# Altium project FIT_PM_TCM_Emulator.PrjPcb (part 3 of 4)

## Sheet SYSTEM.SchDoc
size A3; SheetNumber: 7; SheetTotal: 8; SPICEModelCacheQMXCVTWZ: <root> / <DocumentId>QMXCVTWZ</DocumentId> / <CacheFrame Number="0"> / <Model Name="pk14" Kind="CKT"> / <Text>*.INC dhvqfn.s / .SUBCKT pk14 / +    1   2   3   4   5   6   7   8   9  10 / +   11  12  13  14 / +   15  16  17  18  19  20  21  22  23  24 / +   25  26  27  28 / * Pin Resistance / r1 1 1001 9.078E-02 / r2 2 1002 8.829E-02 / r3 3 1003 8.731E-02 / r4 4 1004 8.710E-02 / r5 5 1005 8.731E-02 / r6 6 1006 8.829E-02 / r7 7 1007 9.075E-02 / r8 8 1008 9.072E-02 / r9 9 1009 8.809E-02 / r10 10 1010 8.716E-02 / r11 11 1011 8.706E-02 / r12 12 1012 8.720E-02 / r13 13 1013 8.816E-02 / r14 14 1014 9.068E-02 / * Pin Inductance / l1 1001 15 2.981E-09 / l2 1002 16 2.447E-09 / l3 1003 17 2.304E-09 / l4 1004 18 2.291E-09 / l5 1005 19 2.307E-09 / l6 1006 20 2.449E-09 / l7 1007 21 2.971E-09 / l8 1008 22 2.972E-09 / l9 1009 23 2.425E-09 / l10 1010 24 2.286E-09 / l11 1011 25 2.280E-09 / l12 1012 26 2.286E-09 / l13 1013 27 2.425E-09 / l14 1014 28 2.975E-09 / .ENDS pk14</Text> / </Model> / <Model Name="kpp" Kind="GlobalParam"> / <Text>.param KPP = 3.0E-05</Text> / </Model> / <Model Name="ldp" Kind="GlobalParam"> / <Text>.param LDP = 0.07U</Text> / </Model> / <Model Name="vtop" Kind="GlobalParam"> / <Text>.param VTOP = 0.14</Text> / </Model> / <Model Name="vt" Kind="GlobalParam"> / <Text>.param VT = 1.380649e-23*(273.15+TEMP)/1.60217662e-19</Text> / </Model> / <Model Name="rpar" Kind="GlobalParam"> / <Text>.param RPAR = 1T</Text> / </Model> / <Model Name="cbdj" Kind="GlobalParam"> / <Text>.param CBDJ = 1</Text> / </Model> / <Model Name="cn" Kind="GlobalParam"> / <Text>.param CN = 0.8</Text> / </Model> / <Model Name="cjp" Kind="GlobalParam"> / <Text>.param CJP = CN*300U</Text> / <Dependency>0\cn</Dependency> / </Model> / <Model Name="ls" Kind="GlobalParam"> / <Text>.param LS = 1.0U</Text> / </Model> / <Model Name="cbds" Kind="GlobalParam"> / <Text>.param CBDS = 1</Text> / </Model> / <Model Name="cjswp" Kind="GlobalParam"> / <Text>.param CJSWP = CN*2.2N</Text> / <Dependency>0\cn</Dependency> / </Model> / <Model Name="epssio2" Kind="GlobalParam"> / <Text>.param EPSSIO2 = 3.9*8.854214871E-12</Text> / </Model> / <Model Name="tox" Kind="GlobalParam"> / <Text>.param TOX = 1000E-10</Text> / </Model> / <Model Name="cox" Kind="GlobalParam"> / <Text>.param COX = EPSSIO2/TOX</Text> / <Dependency>0\epssio2</Dependency> / <Dependency>0\tox</Dependency> / </Model> / <Model Name="xjn" Kind="GlobalParam"> / <Text>.param XJN = 0.2U</Text> / </Model> / <Model Name="cgsop" Kind="GlobalParam"> / <Text>.param CGSOP = CN*0.6 * XJN * COX</Text> / <Dependency>0\cn</Dependency> / <Dependency>0\xjn</Dependency> / <Dependency>0\cox</Dependency> / </Model> / <Model Name="cgdop" Kind="GlobalParam"> / <Text>.param CGDOP = CGSOP</Text> / <Dependency>0\cgsop</Dependency> / </Model> / <Model Name="iimirrp" Kind="CKT"> / <Text>.SUBCKT IIMIRRP VCC IO II PARAMS: W1 = 100U L1 = 10U M1 = 1 W2 = 100U L2= 10U M2 = 2 IDIN = 1U / * / .PARAM L1E = {L1 - LDP} / .PARAM L2E = {L2 - LDP} / .PARAM B1 = {M1*(W1/L1)*(KPP/2)} / .PARAM MR = {M2*W2/L2E/(M1*W1/L1E)} / .PARAM RDS = {1/(2*SQRT(M2*(W2/L2E)*(KPP/2)*IDIN))} / .PARAM IS = 1E-12 / .PARAM NP = {VTOP/(VT*Log(1 + IDIN/IS))} / * / FB VCC IO V1 {MR} / R1 VCC IO {RPAR} / C1 VCC IO {M2*(CBDJ*CJP*LS*W2 + CBDS*CJSWP*(2*LS + W2))} / D1 IO  10  DMODP / V1 VCC 10 {VTOP} / R2 II 10  {RDS} / C2 VCC II {M1*(CBDJ*CJP*LS*W1 + CBDS*CJSWP*(2*LS + W1)) + 2/3*COX*(M1*W1*L1E + M2*W2*L2E) + M1*CGSOP*W1} / C3 II IO {CGDOP*W2} / .MODEL DMODP D (IS={IS} N={NP} ) / .ENDS</Text> / <Dependency>0\kpp</Dependency> / <Dependency>0\ldp</Dependency> / <Dependency>0\vtop</Dependency> / <Dependency>0\vt</Dependency> / <Dependency>0\rpar</Dependency> / <Dependency>0\cbdj</Dependency> / <Dependency>0\cjp</Dependency> / <Dependency>0\ls</Dependency> / <Dependency>0\cbds</Dependency> / <Dependency>0\cjswp</Dependency> / <Dependency>0\cox</Dependency> / <Dependency>0\cgsop</Dependency> / <Dependency>0\cgdop</Dependency> / </Model> / <Model Name="isz" Kind="GlobalParam"> / <Text>.param ISZ = 5P</Text> / </Model> / <Model Name="nz" Kind="GlobalParam"> / <Text>.param NZ = 0.3/(VT*Log(1 + 5.0M/ISZ))</Text> / <Dependency>0\vt</Dependency> / <Dependency>0\isz</Dependency> / </Model> / <Model Name="dz_18v" Kind="MDL"> / <Text>.MODEL DZ_18V D( IS={ISz} N={Nz} BV=18.0 IBV=5.0M EG={8*Nz*VT})</Text> / <Dependency>0\isz</Dependency> / <Dependency>0\nz</Dependency> / <Dependency>0\vt</Dependency> / </Model> / <Model Name="d_z18v" Kind="CKT"> / <Text>* / * CONNECTIONS:   A / *                |    C / *                |    | / .SUBCKT D_Z18V   1    2 / D1 1 2  DZ_18V / .ENDS</Text> / <Dependency>0\dz_18v</Dependency> / </Model> / <Model Name="kpn" Kind="GlobalParam"> / <Text>.param KPN = 6.0E-05</Text> / </Model> / <Model Name="ldn" Kind="GlobalParam"> / <Text>.param LDN = 0.07U</Text> / </Model> / <Model Name="rsw" Kind="GlobalParam"> / <Text>.param RSW = 1810</Text> / </Model> / <Model Name="rsn" Kind="GlobalParam"> / <Text>.param RSN = 1.41</Text> / </Model> / <Model Name="vbmul" Kind="GlobalParam"> / <Text>.param VBMUL = 1E6</Text> / </Model> / <Model Name="vtohp" Kind="GlobalParam"> / <Text>.param VTOHP = 0.85</Text> / </Model> / <Model Name="lambda" Kind="GlobalParam"> / <Text>.param LAMBDA = 2M</Text> / </Model> / <Model Name="vtohn" Kind="GlobalParam"> / <Text>.param VTOHN = 0.80</Text> / </Model> / <Model Name="ibias" Kind="CKT"> / <Text>* / .SUBCKT IBIAS VCC GND VIB / * / .PARAM M1 = 8 / .PARAM M2 = 5 / .PARAM MP = 1 / .PARAM WP = 13U / .PARAM WN = 130U / .PARAM LPE = {36U - LDP} / .PARAM LNE = {13U - LDN} / .PARAM BP = {MP*(WP/LPE)*(KPP/2)} / .PARAM WW = 13U / .PARAM LW = 213U / .PARAM WNN = 25U / .PARAM LNN = 87U / .PARAM R1 = {(RSW*LW/WW + RSN*LNN/WNN)} / .PARAM K2 = {M2*(WN/LNE)*(KPN/2)} / .PARAM MR = {M2/M1} / * / R1 VIB GND {VBMUL} / GB  VCC VIB  VALUE = {LIMIT( IF ( V(VCC,GND) &gt; VTOHP, BP*PWR(V(VCC,GND)-VTOHP, 2), 0), / + (1 + 1*LAMBDA*(V(VCC,GND) - VTOHN))*PWR(( 1 - SQRT(MR/(1+2*LAMBDA*(V(VCC,GND) - VTOHP))) )/R1, 2)/K2, 0)} / R2 VIB VCC {RPAR} / .ENDS</Text> / <Dependency>0\kpp</Dependency> / <Dependency>0\kpn</Dependency> / <Dependency>0\ldn</Dependency> / <Dependency>0\ldp</Dependency> / <Dependency>0\rsw</Dependency> / <Dependency>0\rsn</Dependency> / <Dependency>0\vbmul</Dependency> / <Dependency>0\vtohp</Dependency> / <Dependency>0\lambda</Dependency> / <Dependency>0\vtohn</Dependency> / <Dependency>0\rpar</Dependency> / </Model> / <Model Name="vton" Kind="GlobalParam"> / <Text>.param VTON = 0.14</Text> / </Model> / <Model Name="cjn" Kind="GlobalParam"> / <Text>.param CJN = CN*180U</Text> / <Dependency>0\cn</Dependency> / </Model> / <Model Name="cjswn" Kind="GlobalParam"> / <Text>.param CJSWN = CN*1N</Text> / <Dependency>0\cn</Dependency> / </Model> / <Model Name="cgson" Kind="GlobalParam"> / <Text>.param CGSON = CN*0.6 * XJN * COX</Text> / <Dependency>0\cn</Dependency> / <Dependency>0\xjn</Dependency> / <Dependency>0\cox</Dependency> / </Model> / <Model Name="cgdon" Kind="GlobalParam"> / <Text>.param CGDON = CGSON</Text> / <Dependency>0\cgson</Dependency> / </Model> / <Model Name="iimirrn" Kind="CKT"> / <Text>.SUBCKT IIMIRRN GND IO II PARAMS: W1 = 100U L1 = 10U M1 = 1 W2 = 100U L2= 10U M2 = 2 IDIN = 1U / * / .PARAM L1E = {L1 - LDN} / .PARAM L2E = {L2 - LDN} / .PARAM B1 = {M1*(W1/L1)*(KPN/2)} / .PARAM MR = { M2*W2/L2E/(M1*W1/L1E) } / .PARAM RDS = {1/(2*SQRT(M2*(W2/L2E)*(KPN/2)*IDIN))} / .PARAM IS = 1E-12 / .PARAM NN = {VTON/(VT*Log(1 + IDIN/IS))} / * / FB IO GND V1 {MR} / R1 IO GND {RPAR} / C1 IO GND {M2*(CBDJ*CJN*LS*W2 + CBDS*CJSWN*(2*LS + W2))} / D1 10 IO  DMODN / V1 10 GND {VTON} / R2 II 10  {RDS} / C2 II GND {M1*(CBDJ*CJN*LS*W1 + CBDS*CJSWN*(2*LS + W1)) + 2/3*COX*(M1*W1*L1E + M2*W2*L2E) + M1*CGSON*W1} / C3 II IO {M2*CGDON*W2} / .MODEL DMODN D (IS={IS} N={NN} ) / .ENDS</Text> / <Dependency>0\kpn</Dependency> / <Dependency>0\ldn</Dependency> / <Dependency>0\vton</Dependency> / <Dependency>0\vt</Dependency> / <Dependency>0\rpar</Dependency> / <Dependency>0\cbdj</Dependency> / <Dependency>0\cjn</Dependency> / <Dependency>0\ls</Dependency> / <Dependency>0\cbds</Dependency> / <Dependency>0\cjswn</Dependency> / <Dependency>0\cox</Dependency> / <Dependency>0\cgson</Dependency> / <Dependency>0\cgdon</Dependency> / </Model> / <Model Name="tlc55x_rwelld" Kind="CKT"> / <Text>*$ / .SUBCKT TLC55X_RWELLD  1 2 PARAMS: W = 10U L = 100U / R1 1 2 {RSW*L/W} / .ENDS</Text> / <Dependency>0\rsw</Dependency> / </Model> / <Model Name="tlc55x_rwell" Kind="CKT"> / <Text>*+ RSH= 10 / *$ / .SUBCKT TLC55X_RWELL  1 2 PARAMS: W = 10U L = 100U / XR1 1 2 TLC55X_RWELLD PARAMS: W = {W} L = {L} / .ENDS</Text> / <Dependency>0\tlc55x_rwelld</Dependency> / </Model> / <Model Name="mdswn" Kind="CKT"> / <Text>.SUBCKT MDSWN D S DG GND PARAMS: W = 100U L = 10U M = 1 / * / .PARAM LE = {L - LDN} / * / S1 D S DG GND SWN / C1 D S {M*(CBDJ*CJN*LS*W + CBDS*CJSWN*(2*LS + W))} / *D B / .MODEL SWN VSWITCH ( VON = {0.55} VOFF = {0.49} RON={1/(2*M*(W/LE)*(KPN/2)*10)} ROFF={1G} ) / .ENDS</Text> / <Dependency>0\kpn</Dependency> / <Dependency>0\ldn</Dependency> / <Dependency>0\cbdj</Dependency> / <Dependency>0\cjn</Dependency> / <Dependency>0\ls</Dependency> / <Dependency>0\cbds</Dependency> / <Dependency>0\cjswn</Dependency> / </Model> / <Model Name="ccg" Kind="GlobalParam"> / <Text>.param CCG = 0.2</Text> / </Model> / <Model Name="xjncg" Kind="GlobalParam"> / <Text>.param XJNCG = 0.2U</Text> / </Model> / <Model Name="toxcg" Kind="GlobalParam"> / <Text>.param TOXCG = 1000E-10</Text> / </Model> / <Model Name="coxcg" Kind="GlobalParam"> / <Text>.param COXCG = EPSSIO2/TOXCG</Text> / <Dependency>0\epssio2</Dependency> / <Dependency>0\toxcg</Dependency> / </Model> / <Model Name="cgsoncg" Kind="GlobalParam"> / <Text>.param CGSONCG = CCG*0.6 * XJNCG * COXCG</Text> / <Dependency>0\ccg</Dependency> / <Dependency>0\xjncg</Dependency> / <Dependency>0\coxcg</Dependency> / </Model> / <Model Name="cgdoncg" Kind="GlobalParam"> / <Text>.param CGDONCG = CGSONCG</Text> / <Dependency>0\cgsoncg</Dependency> / </Model> / <Model Name="cjncg" Kind="GlobalParam"> / <Text>.param CJNCG = CCG*180U</Text> / <Dependency>0\ccg</Dependency> / </Model> / <Model Name="cjswncg" Kind="GlobalParam"> / <Text>.param CJSWNCG = CCG*1N</Text> / <Dependency>0\ccg</Dependency> / </Model> / <Model Name="vtomp" Kind="GlobalParam"> / <Text>.param VTOMP = 0.6</Text> / </Model> / <Model Name="tlc55x_pmosd_mv" Kind="MDL"> / <Text>*$ / .MODEL TLC55X_PMOSD_MV PMOS LEVEL=1 L=10U W=100U KP={KPP} VTO={-VTOMP} LAMBDA=2E-3 / *+ CJ={CJP} CJSW={CJSWP} CGSO={CGSOP} CGDO={CGDOP} PB=0.65 LD=70N TOX={TOX} / + CJ={CJNCG} CJSW={CJSWNCG} CGSO={CGSONCG} CGDO={CGDONCG} PB=0.65 LD= 70N TOX={TOXCG}</Text> / <Dependency>0\cgdoncg</Dependency> / <Dependency>0\cgsoncg</Dependency> / <Dependency>0\cjncg</Dependency> / <Dependency>0\cjswncg</Dependency> / <Dependency>0\kpp</Dependency> / <Dependency>0\toxcg</Dependency> / <Dependency>0\vtomp</Dependency> / </Model> / <Model Name="tlc55x_pmos_mv" Kind="CKT"> / <Text>*$ / .SUBCKT TLC55X_PMOS_MV  D G S B PARAMS: W = 100U L = 10U M = 1 / M1 D G S B TLC55X_PMOSD_MV W = {W} L = {L} M = {M} AD={W*LS} AS={W*LS} PD={W + 2*LS} PS={W + 2*LS} / + NRD={LS/W} NRS={LS/W} / .ENDS</Text> / <Dependency>0\tlc55x_pmosd_mv</Dependency> / <Dependency>0\ls</Dependency> / </Model> / <Model Name="mdswp" Kind="CKT"> / <Text>.SUBCKT MDSWP D S DG GND PARAMS: W = 100U L = 10U M = 1 / * / .PARAM LE = {L - LDP} / * / S1 D S DG GND SWN / C1 D S {M*(CBDJ*CJP*LS*W + CBDS*CJSWP*(2*LS + W))} / *D B / .MODEL SWN VSWITCH ( VON = {0.49} VOFF = {0.55} RON={1/(2*M*(W/LE)*(KPP/2)*10)} ROFF={1G} ) / .ENDS</Text> / <Dependency>0\kpp</Dependency> / <Dependency>0\ldp</Dependency> / <Dependency>0\cbdj</Dependency> / <Dependency>0\cjp</Dependency> / <Dependency>0\ls</Dependency> / <Dependency>0\cbds</Dependency> / <Dependency>0\cjswp</Dependency> / </Model> / <Model Name="imirrp" Kind="CKT"> / <Text>.SUBCKT IMIRRP VCC IO VIB GND PARAMS: W = 100U L = 10U M = 1 IO = 1U / * / .PARAM MP = 1 / .PARAM WP = 13U / .PARAM LPE = {36U - LDP} / .PARAM LE = {L - LDP} / .PARAM MR = { M*W/LE/(MP*WP/LPE)/VBMUL } / .PARAM B1 = { (KPP/2*MP*WP/LPE)*VBMUL } / .PARAM IS = 1E-12 / .PARAM N = {VTOHP/(VT*Log(1 + IO/IS))} / * / GB VCC IO VIB GND {MR} / R1 VCC IO {RPAR} / C1 VCC IO {M*(CBDJ*CJP*LS*W + CBDS*CJSWP*(2*LS + W))} / V1 VCC 10 {VTOHP} / D1 IO  10  DMOD1 / .MODEL DMOD1 D (IS={IS} N={N} ) / .ENDS</Text> / <Dependency>0\kpp</Dependency> / <Dependency>0\vbmul</Dependency> / <Dependency>0\ldp</Dependency> / <Dependency>0\vtohp</Dependency> / <Dependency>0\vt</Dependency> / <Dependency>0\rpar</Dependency> / <Dependency>0\cbdj</Dependency> / <Dependency>0\cjp</Dependency> / <Dependency>0\ls</Dependency> / <Dependency>0\cbds</Dependency> / <Dependency>0\cjswp</Dependency> / </Model> / <Model Name="comp2inpnorsd" Kind="CKT"> / <Text>.SUBCKT COMP2INPNORSD IN1+ IN1- IN2+ IN2- OUT GND / + PARAMS: ROUT=0 DELAYLH=0 DELAYHL=0 VOUTH=0 VOUTL=0 VTHRES1=0 VTHRES2=0 / * / .PARAM TDELLH = {IF ( (DELAYLH &lt; 1E-9) , 1E-9, DELAYLH ) } / .PARAM TDELHL = {IF ( (DELAYHL &lt; 1E-9) , 1E-9, DELAYHL ) } / .PARAM RO = {IF ( (TDEL &gt; 1E-15) &amp; (ROUT &lt; 1), 1, ROUT ) } / .PARAM TDEL = {(TDELLH+TDELHL)/2} / .PARAM COUT={TDEL/(0.693*(RO+1U))} / .PARAM RDELLH = {TDELLH/(0.693*(COUT+1F))} / .PARAM RDELHL = {TDELHL/(0.693*(COUT+1F))} / EOUT OUT GND VALUE= { IF ( (V(IN1+,IN1-) &gt; {VTHRES1}) | (V(IN2+,IN2-) &gt; {VTHRES2}), / + VOUTL + RDELLH*I(EOUT), VOUTH + RDELHL*I(EOUT) ) } / COUT OUT GND {COUT} / .ENDS COMP2INPNORSD</Text> / </Model> / <Model Name="comp3inpnorsd" Kind="CKT"> / <Text>.SUBCKT COMP3INPNORSD IN1+ IN1- IN2+ IN2- IN3+ IN3- OUT VCC GND / + PARAMS: ROUT=0 DELAYLH=0 DELAYHL=0 VOUTH=0 VOUTL=0 VTHRES1=0 VHYST1=0 VTHRES2=0 VHYST2=0 VTHRES3=0 VHYST3=0 / * / .PARAM TDELLH = {IF ( (DELAYLH &lt; 1E-9) , 1E-9, DELAYLH ) } / .PARAM TDELHL = {IF ( (DELAYHL &lt; 1E-9) , 1E-9, DELAYHL ) } / .PARAM RO = {IF ( (TDEL &gt; 1E-15) &amp; (ROUT &lt; 1), 1, ROUT ) } / .PARAM TDEL = {(TDELLH+TDELHL)/2} / .PARAM COUT={TDEL/(0.693*(RO+1U))} / .PARAM VREFN = {(15-VTOHN)} / .PARAM VREFP = {(15-VTOHP)} / .PARAM RDELLH = {TDELLH/(0.693*(COUT+1F))*VREFP} / .PARAM RDELHL = {TDELHL/(0.693*(COUT+1F))*VREFN} / * / EOUT OUT GND VALUE= { IF ( (V(IN1+,IN1-) &gt; {VTHRES1}) | (V(IN2+,IN2-) &gt; {VTHRES2}) | (V(IN3+,IN3-) &gt; {VTHRES3}), / + VOUTL + RDELLH*I(EOUT)*V(1,GND), VOUTH + RDELHL*I(EOUT)*V(1,GND) ) } / E1 1 GND VALUE= { IF ( (V(VCC,GND) &gt; {VTOHP+0.01}), 1/(V(VCC,GND)-VTOHP), 100 ) } / COUT OUT GND {COUT} / .ENDS COMP3INPNORSD</Text> / <Dependency>0\vtohn</Dependency> / <Dependency>0\vtohp</Dependency> / </Model> / <Model Name="rr1sff" Kind="CKT"> / <Text>.SUBCKT RR1SFF S R R1 Q  Q_ VCC GND / + PARAMS: VOUTH=5.0 VOUTL=0 RIN=1E12 DELAY=10N ROUT=10 / .PARAM W1 = 100U / .PARAM L1 = 10U / .PARAM W2 = 100U / .PARAM L2= 10U / .PARAM W3 = 10U / .PARAM L3 = 25U / .PARAM W4 = 10U / .PARAM L4= 100U / * / XU1     Q GND S GND Q_ GND   COMP2INPNORSD / + PARAMS: ROUT={ROUT} DELAYLH={1N} DELAYHL={1N} VOUTH={VOUTH} VOUTL={VOUTL} / + VTHRES1={0.5*(VOUTH-VOUTL)} VTHRES2={VTOCN} / XU2     VCC R R1 GND Q_ GND Q VCC GND   COMP3INPNORSD / + PARAMS: ROUT={ROUT} DELAYLH={15N} DELAYHL={1N} VOUTH={VOUTH} VOUTL={VOUTL} / + VTHRES1={VTOCP} VTHRES2={VTOCN} VTHRES3={0.49*(VOUTH-VOUTL)} / *C1 S GND {0.5*COX*(W1*L1) + CGSON*W1} / *C2 R VCC {0.5*COX*(W2*L2) + CGSOP*W2} / *C3 R1 GND {0.5*COX*(W3*L3) + CGSON*W3} / *C4 R1 VCC {0.5*COX*(W4*L4) + CGSOP*W4} / .ENDS</Text> / <Dependency>0\comp2inpnorsd</Dependency> / <Dependency>0\comp3inpnorsd</Dependency> / </Model> / <Model Name="vtomn" Kind="GlobalParam"> / <Text>.param VTOMN = 0.55</Text> / </Model> / <Model Name="tlc55x_nmosd_mv" Kind="MDL"> / <Text>*$ / .MODEL TLC55X_NMOSD_MV NMOS LEVEL=1 L=10U W=100U KP={KPN} VTO={VTOMN} LAMBDA=2E-3 / + CJ={CJNCG} CJSW={CJSWNCG} CGSO={CGSONCG} CGDO={CGDONCG} PB=0.65 LD= 70N TOX={TOXCG}</Text> / <Dependency>0\cgdoncg</Dependency> / <Dependency>0\cgsoncg</Dependency> / <Dependency>0\cjncg</Dependency> / <Dependency>0\cjswncg</Dependency> / <Dependency>0\kpn</Dependency> / <Dependency>0\toxcg</Dependency> / <Dependency>0\vtomn</Dependency> / </Model> / <Model Name="tlc55x_nmos_mv" Kind="CKT"> / <Text>*$ / .SUBCKT TLC55X_NMOS_MV  D G S B PARAMS: W = 100U L = 10U M = 1 / M1 D G S B TLC55X_NMOSD_MV W = {W} L = {L} M = {M} AD={W*LS} AS={W*LS} PD={W + 2*LS} PS={W + 2*LS} / + NRD={LS/W} NRS={LS/W} / .ENDS</Text> / <Dependency>0\tlc55x_nmosd_mv</Dependency> / <Dependency>0\ls</Dependency> / </Model> / <Model Name="mswn" Kind="CKT"> / <Text>.SUBCKT MSWN D G S PARAMS: W = 100U L = 10U M = 1 / * / .PARAM LE = {L - LDN} / * / *C1 D S {M*(CBDJ*CJN*LS*W + CBDS*CJSWN*(2*LS + W))} / *D B / *C2 G S {M*2/3*COX*(W*LE) + CGSON*W} / *C3 G D {CGDON*W} / S1 D S G S SWN / .MODEL SWN VSWITCH ( VON = {VTON+1} VOFF = {VTON} RON={1/(2*M*(W/L)*(KPN/2)*10)} ROFF={1G} ) / .ENDS</Text> / <Dependency>0\vton</Dependency> / <Dependency>0\kpn</Dependency> / <Dependency>0\ldn</Dependency> / </Model> / <Model Name="tlc55x_nmosd_hv" Kind="MDL"> / <Text>*$ / .MODEL TLC55X_NMOSD_HV NMOS LEVEL=3 L=10U W=100U KP={KPN} VTO={VTOHN} LAMBDA=2E-3 THETA=1.8E-01 / + CJ={CJN} CJSW={CJSWN} CGSO={CGSON} CGDO={CGDON} RSH= 10 PB=0.65 LD= 70N TOX={TOX}</Text> / <Dependency>0\cgdon</Dependency> / <Dependency>0\cgson</Dependency> / <Dependency>0\cjn</Dependency> / <Dependency>0\cjswn</Dependency> / <Dependency>0\kpn</Dependency> / <Dependency>0\tox</Dependency> / <Dependency>0\vtohn</Dependency> / </Model> / <Model Name="tlc55x_nmos_hv" Kind="CKT"> / <Text>.SUBCKT TLC55X_NMOS_HV  D G S B PARAMS: W = 100U L = 10U M = 1 / M1 D G S B TLC55X_NMOSD_HV W = {W} L = {L} M = {M} AD={W*LS} AS={W*LS} PD={W + 2*LS} PS={W + 2*LS} / + NRD={LS/W} NRS={LS/W} / .ENDS</Text> / <Dependency>0\tlc55x_nmosd_hv</Dependency> / <Dependency>0\ls</Dependency> / </Model> / <Model Name="tlc55x_pmosd_hv" Kind="MDL"> / <Text>*$ / .MODEL TLC55X_PMOSD_HV PMOS LEVEL=3 L=10U W=100U KP={KPP} VTO={-VTOHP} LAMBDA=2E-3 THETA=2.2E-01 / + CJ={CJP} CJSW={CJSWP} CGSO={CGSOP} CGDO={CGDOP} RSH=10 PB=0.65 LD=70N TOX={TOX}</Text> / <Dependency>0\cgdop</Dependency> / <Dependency>0\cgsop</Dependency> / <Dependency>0\cjp</Dependency> / <Dependency>0\cjswp</Dependency> / <Dependency>0\kpp</Dependency> / <Dependency>0\tox</Dependency> / <Dependency>0\vtohp</Dependency> / </Model> / <Model Name="tlc55x_pmos_hv" Kind="CKT"> / <Text>*+ RSH= 10 / *$ / .SUBCKT TLC55X_PMOS_HV  D G S B PARAMS: W = 100U L = 10U M = 1 / M1 D G S B TLC55X_PMOSD_HV W = {W} L = {L} M = {M} AD={W*LS} AS={W*LS} PD={W + 2*LS} PS={W + 2*LS} / + NRD={LS/W} NRS={LS/W} / .ENDS</Text> / <Dependency>0\tlc55x_pmosd_hv</Dependency> / <Dependency>0\ls</Dependency> / </Model> / <Model Name="tlc55x_nmosd_hv_l1" Kind="MDL"> / <Text>*$ / .MODEL TLC55X_NMOSD_HV_L1 NMOS LEVEL=1 L=10U W=100U KP={KPN} VTO={VTOHN} LAMBDA=2E-3 / + CJ={CJN} CJSW={CJSWN} CGSO={CGSON} CGDO={CGDON} RSH= 10 PB=0.65 LD= 70N TOX={TOX}</Text> / <Dependency>0\cgdon</Dependency> / <Dependency>0\cgson</Dependency> / <Dependency>0\cjn</Dependency> / <Dependency>0\cjswn</Dependency> / <Dependency>0\kpn</Dependency> / <Dependency>0\tox</Dependency> / <Dependency>0\vtohn</Dependency> / </Model> / <Model Name="tlc55x_nmos_hv_l1" Kind="CKT"> / <Text>*$ / .SUBCKT TLC55X_NMOS_HV_L1  D G S B PARAMS: W = 100U L = 10U M = 1 / M1 D G S B TLC55X_NMOSD_HV_L1 W = {W} L = {L} M = {M} AD={W*LS} AS={W*LS} PD={W + 2*LS} PS={W + 2*LS} / + NRD={LS/W} NRS={LS/W} / .ENDS</Text> / <Dependency>0\tlc55x_nmosd_hv_l1</Dependency> / <Dependency>0\ls</Dependency> / </Model> / <Model Name="tlc55x_pmosd_lv" Kind="MDL"> / <Text>*+ RSH= 10 / *$ / .MODEL TLC55X_PMOSD_LV PMOS LEVEL=1 L=10U W=100U KP={KPP} VTO={-VTOP} LAMBDA=2E-3 / + CJ={CJP} CJSW={CJSWP} CGSO={CGSOP} CGDO={CGDOP}  PB=0.65 LD=300N TOX={TOX}</Text> / <Dependency>0\cgdop</Dependency> / <Dependency>0\cgsop</Dependency> / <Dependency>0\cjp</Dependency> / <Dependency>0\cjswp</Dependency> / <Dependency>0\kpp</Dependency> / <Dependency>0\tox</Dependency> / <Dependency>0\vtop</Dependency> / </Model> / <Model Name="tlc55x_pmos_lv" Kind="CKT"> / <Text>*$ / .SUBCKT TLC55X_PMOS_LV  D G S B PARAMS: W = 100U L = 10U M = 1 / M1 D G S B TLC55X_PMOSD_LV W = {W} L = {L} M = {M} AD={W*LS} AS={W*LS} PD={W + 2*LS} PS={W + 2*LS} / + NRD={LS/W} NRS={LS/W} / .ENDS</Text> / <Dependency>0\tlc55x_pmosd_lv</Dependency> / <Dependency>0\ls</Dependency> / </Model> / <Model Name="tlc555" Kind="CKT"> / <Text>.SUBCKT TLC555 THRES CONT TRIG RESET OUT DISC VCC GND / XD8          GND RESI   D_Z18V / XD7          GND RESET   D_Z18V / XR2          RESET RESI   TLC55X_RWELL / + PARAMS: W=50u L=20u / XD2          GND TRGI   D_Z18V / XD1          GND TRIG   D_Z18V / XR3          TRIG TRGI   TLC55X_RWELL / + PARAMS: W=50u L=20u / XD4          GND THRI   D_Z18V / XD3          GND THRES   D_Z18V / XR2_2        THRES THRI   TLC55X_RWELL / + PARAMS: W=50u L=20u / XD6          GND CONTI   D_Z18V / XD5          GND CONT   D_Z18V / XR2_3        CONT CONTI   TLC55X_RWELL / + PARAMS: W=50u L=20u / XMN15        GOUT GND QFF GND   MDSWN / + PARAMS: W=100U L=10U M=7 / XMP15        GOUT VCC QFF GND   MDSWP / + PARAMS: W=195U L=10U M=9 / XMN3         GND TRGO 23   IIMIRRN / + PARAMS: W1=170U L1=18U M1=1 W2=170U L2=18U M2=1 IDIN=1U / XMN5         GND THRS 25   IIMIRRN / + PARAMS: W1=13U L1=26U M1=1 W2=52U L2=13U M2=2 IDIN=50N / XMp9         VCC RESO 15 GND   IMIRRP / + PARAMS: W=112U L=15U M=2 IO=2U / XMp6         VCC 25 15 GND   IMIRRP / + PARAMS: W=18U L=26U M=1 IO=100n / XMp5         VCC TRGS 15 GND   IMIRRP / + PARAMS: W=112U L=15U M=2 IO=2U / XMp1         VCC THRO 29   IIMIRRP / + PARAMS: W1=172U L1=15U M1=1 W2=172U L2=15U M2=1 IDIN=1U / XIB          VCC GND 15   IBIAS / XRSFF        TRGO THRO RESO QFF 30 VCC GND   RR1SFF / + PARAMS: VOUTH=1 VOUTL=0 RIN=1E12 DELAY=30N ROUT=10 / XMN9         TRGO RESO GND   MSWN / + PARAMS: W=100U L=10U M=1 / XMN17        DISC GOUT GND GND   TLC55X_NMOS_HV / + PARAMS: W=350U L=10U M=20 / XMN16        OUT GOUT GND GND   TLC55X_NMOS_HV / + PARAMS: W=175U L=10U M=20 / XMP16        OUT GOUT VCC VCC   TLC55X_PMOS_HV / + PARAMS: W=270u L=10u M=7 / XMN10        RESO RESI GND GND   TLC55X_NMOS_HV_L1 / + PARAMS: W=100u L=10u M=1 / XMN2         THRO THRI THRS GND   TLC55X_NMOS_MV / + PARAMS: W=170u L=18u M=2 / XMP4         TRGO TRGI TRGS VCC   TLC55X_PMOS_MV / + PARAMS: W=172u L=15u M=2 / XMP3         23 TRGC TRGS VCC   TLC55X_PMOS_MV / + PARAMS: W=172u L=15u M=2 / XMPR1F       GND GND 32 TRGC   TLC55X_PMOS_LV / + PARAMS: W=20U L=15U M=1 / XMPR1E       32 32 TRGC TRGC   TLC55X_PMOS_LV / + PARAMS: W=20U L=15U M=1 / XMPR1D       TRGC TRGC 33 CONTI   TLC55X_PMOS_LV / + PARAMS: W=20U L=15U M=1 / XMPR1C       33 33 CONTI CONTI   TLC55X_PMOS_LV / + PARAMS: W=20U L=15U M=1 / XMPR1B       CONTI CONTI 34 VCC   TLC55X_PMOS_LV / + PARAMS: W=20u L=15u M=1 / XMPR1A       34 34 VCC VCC   TLC55X_PMOS_LV / + PARAMS: W=20u L=15u M=1 / XMN1         29 CONTI THRS GND   TLC55X_NMOS_MV / + PARAMS: W=170u L=18u M=2 / .ENDS TLC555</Text> / <Dependency>0\iimirrp</Dependency> / <Dependency>0\d_z18v</Dependency> / <Dependency>0\ibias</Dependency> / <Dependency>0\iimirrn</Dependency> / <Dependency>0\tlc55x_rwell</Dependency> / <Dependency>0\mdswn</Dependency> / <Dependency>0\tlc55x_pmos_mv</Dependency> / <Dependency>0\mdswp</Dependency> / <Dependency>0\imirrp</Dependency> / <Dependency>0\rr1sff</Dependency> / <Dependency>0\tlc55x_nmos_mv</Dependency> / <Dependency>0\mswn</Dependency> / <Dependency>0\tlc55x_nmos_hv</Dependency> / <Dependency>0\tlc55x_pmos_hv</Dependency> / <Dependency>0\tlc55x_nmos_hv_l1</Dependency> / <Dependency>0\tlc55x_pmos_lv</Dependency> / </Model> / <Model Name="bsh103" Kind="CKT"> / <Text>.SUBCKT BSH103 DRAIN GATE SOURCE / LD DRAIN 5 7e-10 / RLD2 DRAIN 5 1.7592904 / RLD1 5 4 0.00035 / LG GATE 1 2.8e-09 / RLG GATE 1 7.0371616 / LS SOURCE 8 8e-10 / RLS2 SOURCE 8 2.0106176 / RLS1 8 7 0.0069 / RDS 7 4 240000000 TC=-0.05 / RS 6 7 0.0001 / RD 3 4 0.167989599257517 TC=0.00346248128119176,-2.23221620156079e-06 / RBD 9 4 0.0853481926973045 TC=0.00346248128119176,-2.23221620156079e-06 / DBD 7 9 DBD / M1 3 2 6 6 MINT / RGS 2 6 80000000 / CGS 2 6 7.24e-11 / RG 1 2 1.767 / * CGD / C11    11   12   1E-12 / V11    11   0   0Vdc / G11    3 2 VALUE { V(13, 0)*I(V11) } / E11    12   0  3 2  1 / E12    13   0  TABLE {V(12)} / + -10	175 / + -5	175 / + -2	175 / + -1	175 / + -0.5	175 / + -0.2	175 / + -0.1	175 / + 0	175 / + 0.01	175 / + 0.5	100 / + 1	70 / + 1.5	60 / + 2	52 / + 2.5	46 / + 3	41 / + 3.5	38 / + 4	35 / + 4.5	33 / + 5	30 / + 7.5	25 / + 10	20 / + 12.5	19 / + 15	18 / + 17.5	16 / + 20	15 / + 25	14 / .MODEL MINT NMOS(Vto=0.8044653308583916 Kp=2.995 Nfs=600e+09 Eta=0 / + Level=3 L=1e-4 W=1e-4 Gamma=0 Phi=0.6 Is=1e-24 / + Js=0 Pb=0.8 Cj=0 Cjsw=0 Cgso=0 Cgdo=0 Cgbo=0 / + Tox=1e-07 Xj=0 / + U0=600 Vmax=4000) / .MODEL DBD D(Bv=30.00 Ibv=1.00E-05 Rs=1E-6 Is=6.14153744662471e-14 / + N=1 M=0.1 VJ=0.5 Fc=0.5 Cjo=0 Tt=2.5e-09) / .ENDS</Text> / </Model> / </CacheFrame> / </root>
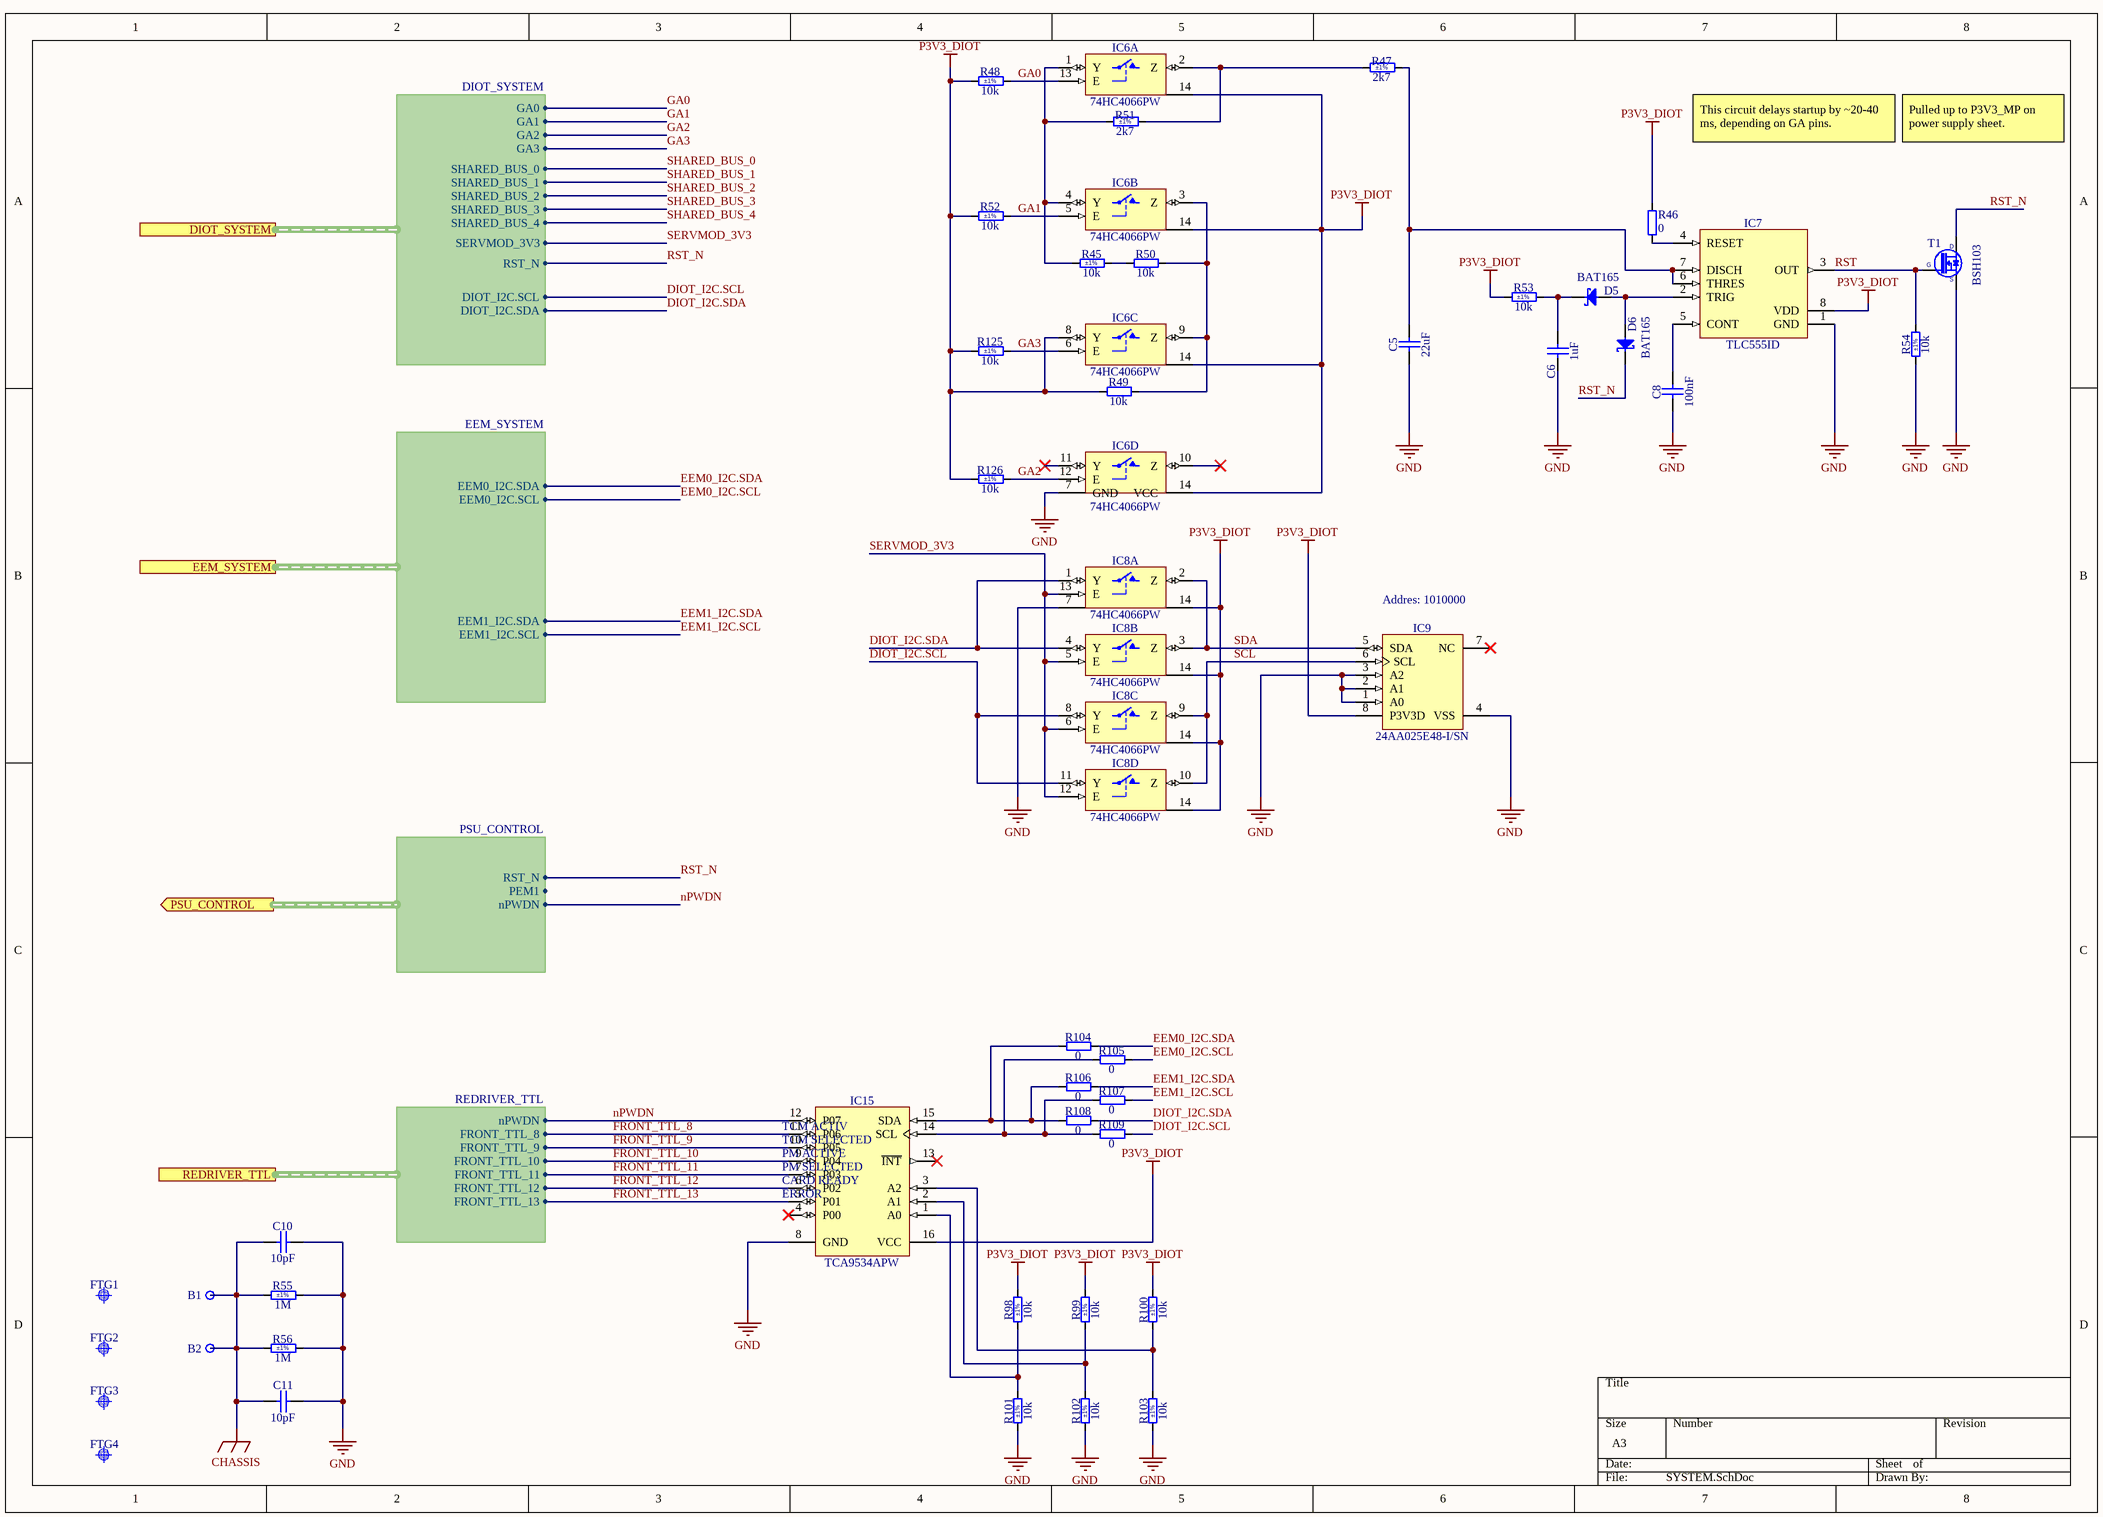
[diagram p6: SYSTEM.SchDoc]

### Parts
B1  Plated Hole  [MTG320_550]  (value not drawn)  (no BOM)
B2  Plated Hole  [MTG320_550]  (value not drawn)  (no BOM)
C5  22uF  [CAPC1608X90N]
C6  1uF  [CAPC1005X55N]
C8  100nF  [CAPC1005X55N]
C10  10pF  [CAPC2013X100N]
C11  10pF  [CAPC2013X100N]
D5  BAT165  [SOD2512X110N]
D6  BAT165  [SOD2512X110N]
FTG1  Use only in PCB  [FIDUCIAL_TOP_C100-200]  (value not drawn)
FTG2  Use only in PCB  [FIDUCIAL_TOP_C100-200]  (value not drawn)
FTG3  Use only in PCB  [FIDUCIAL_TOP_C100-200]  (value not drawn)
FTG4  Use only in PCB  [FIDUCIAL_TOP_C100-200]  (value not drawn)
IC6  74HC4066PW  [SOP65P640X110-14N]  (parts A,B,C,D of 4)
IC7  TLC555ID  [SOIC127P600X175-8N]
IC8  74HC4066PW  [SOP65P640X110-14N]  (parts A,B,C,D of 4)
IC9  24AA025E48-I/SN  [SOIC127P600X175-8N]
IC15  TCA9534APW  [SOP65P640X120-16N]
R45  10k  Tolerance: ±1%  [RESC1005X40N]
R46  0  [RESC1005X40N]
R47  2k7  Tolerance: ±1%  [RESC1608X55N]
R48  10k  Tolerance: ±1%  [RESC1005X40N]
R49  10k  [RESC1005X40N]
R50  10k  [RESC1005X40N]
R51  2k7  Tolerance: ±1%  [RESC1608X55N]
R52  10k  Tolerance: ±1%  [RESC1005X40N]
R53  10k  Tolerance: ±1%  [RESC1005X40N]
R54  10k  Tolerance: ±1%  [RESC1005X40N]
R55  1M  Tolerance: ±1%  [RESC2012X60N]
R56  1M  Tolerance: ±1%  [RESC2012X60N]
R98  10k  Tolerance: ±1%  [RESC1608X55N]
R99  10k  Tolerance: ±1%  [RESC1608X55N]
R100  10k  Tolerance: ±1%  [RESC1608X55N]
R101  10k  Tolerance: ±1%  [RESC1608X55N]
R102  10k  Tolerance: ±1%  [RESC1608X55N]
R103  10k  Tolerance: ±1%  [RESC1608X55N]
R104  0  [RESC1608X55N]
R105  0  [RESC1608X55N]
R106  0  [RESC1608X55N]
R107  0  [RESC1608X55N]
R108  0  [RESC1608X55N]
R109  0  [RESC1608X55N]
R125  10k  Tolerance: ±1%  [RESC1005X40N]
R126  10k  Tolerance: ±1%  [RESC1005X40N]
T1  BSH103  [SOT95P230X110-3N]

### Ports
DIOT_SYSTEM (harness DIOT_SYSTEM, see BLOCK_DIAGRAM[7B], DIOT_CONN[8C]), EEM_SYSTEM (harness EEM_SYSTEM, see BLOCK_DIAGRAM[7B], EEM_CONN[4D]), PSU_CONTROL (out, harness PSU_CONTROL, see BLOCK_DIAGRAM[7B], PSU[1B]), REDRIVER_TTL (harness REDRIVER_TTL, see BLOCK_DIAGRAM[8B], REDRIVERS[8D])

### Harnesses
EEM_SYSTEM: EEM0_I2C.SDA, EEM0_I2C.SCL, EEM1_I2C.SDA, EEM1_I2C.SCL
DIOT_SYSTEM: GA0, GA1, GA2, GA3, SHARED_BUS_0, SHARED_BUS_1, SHARED_BUS_2, SHARED_BUS_3, SHARED_BUS_4, SERVMOD_3V3, RST_N, DIOT_I2C.SCL, DIOT_I2C.SDA
PSU_CONTROL: RST_N, PEM1, nPWDN
REDRIVER_TTL: nPWDN, FRONT_TTL_8, FRONT_TTL_9, FRONT_TTL_10, FRONT_TTL_11, FRONT_TTL_12, FRONT_TTL_13

### Nets
CHASSIS: B1.1 B2.1 C10.1 C11.1 R55.1 R56.1
GND: C5.1 C6.1 C8.1 C10.2 C11.2 IC6.7(GND) IC7.1(GND) IC8.7(GND) IC9.1(A0) IC9.2(A1) IC9.3(A2) IC9.4(VSS) IC15.8(GND) R54.1 R55.2 R56.2 R101.1 R102.1 R103.1 T1.2(S)
P3V3_DIOT: IC6.8(Y) IC6.14(VCC) IC7.8(VDD) IC8.14(P3V3D) IC9.8(P3V3D) IC15.16(VCC) R46.2 R48.1 R49.1 R52.1 R53.1 R98.2 R99.2 R100.2 R125.1 R126.1
DIOT_I2C.SCL: IC8.8(Y) IC8.11(Y) R109.2 ; port DIOT_SYSTEM.DIOT_I2C.SCL
DIOT_I2C.SDA: IC8.1(Y) IC8.4(Y) R108.2 ; port DIOT_SYSTEM.DIOT_I2C.SDA
EEM0_I2C.SCL: R105.2 ; port EEM_SYSTEM.EEM0_I2C.SCL
EEM0_I2C.SDA: R104.2 ; port EEM_SYSTEM.EEM0_I2C.SDA
EEM1_I2C.SCL: R107.2 ; port EEM_SYSTEM.EEM1_I2C.SCL
EEM1_I2C.SDA: R106.2 ; port EEM_SYSTEM.EEM1_I2C.SDA
FRONT_TTL_8: IC15.11(P06) ; port REDRIVER_TTL.FRONT_TTL_8
FRONT_TTL_9: IC15.10(P05) ; port REDRIVER_TTL.FRONT_TTL_9
FRONT_TTL_10: IC15.9(P04) ; port REDRIVER_TTL.FRONT_TTL_10
FRONT_TTL_11: IC15.7(P03) ; port REDRIVER_TTL.FRONT_TTL_11
FRONT_TTL_12: IC15.6(P02) ; port REDRIVER_TTL.FRONT_TTL_12
FRONT_TTL_13: IC15.5(P01) ; port REDRIVER_TTL.FRONT_TTL_13
GA0: IC6.13(E) R48.2 ; port DIOT_SYSTEM.GA0
GA1: IC6.5(E) R52.2 ; port DIOT_SYSTEM.GA1
GA2: IC6.12(E) R126.2 ; port DIOT_SYSTEM.GA2
GA3: IC6.6(E) R125.2 ; port DIOT_SYSTEM.GA3
nPWDN: IC15.12(P07) ; port PSU_CONTROL.nPWDN, port REDRIVER_TTL.nPWDN
RST: IC7.3(OUT) R54.2 T1.1(G)
RST_N: D6.1(C) T1.3(D) ; port DIOT_SYSTEM.RST_N, port PSU_CONTROL.RST_N
SCL: IC8.9(Z) IC8.10(Z) IC9.6(SCL)
SDA: IC8.2(Z) IC8.3(Z) IC9.5(SDA)
SERVMOD_3V3: IC8.5(E) IC8.6(E) IC8.12(E) IC8.13(E) ; port DIOT_SYSTEM.SERVMOD_3V3
NetC5_2: C5.2 IC7.6(THRES) IC7.7(DISCH) R47.2
NetC6_2: C6.2 D5.1(C) R53.2
NetC8_2: C8.2 IC7.5(CONT)
NetD5_2: D5.2(A) D6.2(A) IC7.2(TRIG)
NetIC6_1: IC6.1(Y) IC6.4(Y) R45.2 R51.1
NetIC6_2: IC6.2(Z) R47.1 R51.2
NetIC6_3: IC6.3(Z) IC6.9(Z) R49.2 R50.2
NetIC7_4: IC7.4(RESET) R46.1
NetIC15_1: IC15.1(A0) R98.1 R101.2
NetIC15_2: IC15.2(A1) R99.1 R102.2
NetIC15_3: IC15.3(A2) R100.1 R103.2
NetIC15_14: IC15.14(SCL) R105.1 R107.1 R109.1
NetIC15_15: IC15.15(SDA) R104.1 R106.1 R108.1
NetR45_1: R45.1 R50.1

Not connected (* = marked no-connect by the designer): IC6 10(Z)* 11(Y)*; IC9 7(NC)*; IC15 4(P00)* 13(~{INT})*

### Notes on the sheet
- This circuit delays startup by ~20-40 ms, depending on GA pins.
- Pulled up to P3V3_MP on power supply sheet.
- (near IC9) Addres: 1010000
- (near IC15) TCM ACTIV
- (near IC15) TCM SELECTED
- (near IC15) PM ACTIVE
- (near IC15) PM SELECTED
- (near IC15) CARD READY
- (near IC15) ERROR

### Library data of the parts
B1 B2 = PLATED_HOLE3.2_PAD5.5: Single Terminal Socket; Part Description: Plated Through Hole: Hole Dia.=3.2mm Pad Dia.=5.5mm; Mounted: No; Part Number: PLATED_HOLE3.2_PAD5.5; Component Type: Standard (No BOM); Pin Count: 1; Family: Plated Hole; Socket: No; SMD: No; Sense: No; Status: None; ComponentHeight: 0mm; HelpURL: Undefined; Author: CERN DEM JMW; CreateDate: 01.10.2012; LatestRevisionDate: 01.10.2012; PackageDescription: Plated Through Hole: Hole Dia.=3.2mm Pad Dia.=5.5mm
C5 = CC0603_22UF_6.3V_20%_X5R: Non-polarised capacitor; Manufacturer: GENERIC; Part Description: SMD Multilayer Chip Ceramic Capacitor; Manufacturer1 Part Number: C1608X5R0J226M080; Voltage: 6.3V; TC: X5R; Tolerance: ±20%; Part Number: CC0603_22UF_6.3V_20%_X5R; Component Kind: Standard; Component Type: Standard; Pin Count: 2; Value: 22uF; Status: None; Manufacturer Part Number: CC0603_22UF_6.3V_20%_X5R; Case: 0603; Mounted: Yes; Socket: No; SMD: Yes; Sense: No; Manufacturer1 Example: TDK; Manufacturer1 ComponentHeight: 0.9mm; HelpURL: \\cern.ch\dfs\Applications\Altium\Datasheets\CC0603_X5R_TDK_C.pdf; Author: CERN DEM JLC; CreateDate: 2013-12-16; LatestRevisionDate: 2020-12-03
C6 = CC0402_1UF_16V_10%_X5R: Non-polarised capacitor; Part Description: SMD Multilayer Chip Ceramic Capacitor; Manufacturer: GENERIC; Manufacturer1 Part Number: C1005X5R1C105KT; Voltage: 16V; TC: X5R; Tolerance: ±10%; Part Number: CC0402_1UF_16V_10%_X5R; Component Kind: Standard; Component Type: Standard; Pin Count: 2; Value: 1uF; Status: Preferred; Manufacturer Part Number: CC0402_1UF_16V_10%_X5R; Case: 0402; Mounted: Yes; Socket: No; SMD: Yes; Sense: No; Manufacturer1 Example: TDK; Manufacturer1 ComponentHeight: 0.55mm; HelpURL: \\cern.ch\dfs\Applications\Altium\Datasheets\CC0402_X5R_TDK_C.pdf; Author: CERN DEM JLC; CreateDate: 2012-10-25; LatestRevisionDate: 2012-10-25
C8 = CC0402_100NF_16V_10%_X5R: Non-polarised capacitor; Part Description: SMD Multilayer Chip Ceramic Capacitor; Manufacturer: GENERIC; Manufacturer1 Part Number: GRM155R61C104KA88D; Voltage: 16V; TC: X5R; Tolerance: ±10%; Part Number: CC0402_100NF_16V_10%_X5R; Component Kind: Standard; Component Type: Standard; Pin Count: 2; Value: 100nF; Status: None; Manufacturer Part Number: CC0402_100NF_16V_10%_X5R; Case: 0402; Mounted: Yes; Socket: No; SMD: Yes; Sense: No; Manufacturer1 Example: MURATA; Manufacturer1 ComponentHeight: 0.55mm; HelpURL: \\cern.ch\dfs\Applications\Altium\Datasheets\CC0402_X5R_MURATA_GRM.pdf; Author: CERN DEM JLC; CreateDate: 10.12.2013; LatestRevisionDate: 10.12.2013
C10 C11 = CC0805_10PF_250V_5%_C0G_KEMET_HiQ-CBR: Non-polarised capacitor; Part Description: High Q and low ESR, SMD Multilayer Chip Ceramic Capacitor, HiQ-CBR Series; Manufacturer: KEMET; Manufacturer Part Number: CBR08C100JAGAC; Voltage: 250V; TC: C0G/NP0; Tolerance: ±5%; Part Number: CC0805_10PF_250V_5%_C0G_KEMET_HiQ-CBR; Component Kind: Standard; Component Type: Standard; Pin Count: 2; Value: 10pF; Case: 0805; Mounted: Yes; Socket: No; SMD: Yes; Sense: No; ComponentHeight: 0.95mm; HelpURL: \\cern.ch\dfs\Applications\Altium\Datasheets\CC0805_C0G_KEMET_HiQ-CBR.pdf; Author: CERN DEM JLC; CreateDate: 16.01.2014; LatestRevisionDate: 21.11.2017
D5 D6 = BAT165: Schottky Diode; Part Description: Medium Power AF Schottky Diode; Manufacturer: INFINEON; Voltage: 40V; Power: 750mA; PressFit: No; Bonding: No; Part Number: BAT165; Component Kind: Standard; Component Type: Standard; Device: BAT165; PackageDescription: Small Outline Diode (SOD-323), 1.70mm W X 1.25mm L X 1.10mm H body,  IPC Medium Density; Manufacturer Part Number: BAT165; Pin Count: 2; Case: SOD-323; Mounted: Yes; Socket: No; SMD: Yes; Sense: No; ComponentHeight: 1.1mm; HelpURL: \\cern.ch\dfs\Applications\Altium\Datasheets\BAT165.pdf; Author: CERN DEM JLC; CreateDate: 12.11.2014; LatestRevisionDate: 12.11.2014
FTG1-FTG4 = FIDUCIAL_TARGET_C100-200: Fiducial Target; Part Description: Round Fiducial Target, Top Layer, 1.0mm, Top Solder 2.0mm, Keepout =2.0mm; Mounted: No; Part Number: FIDUCIAL_TARGET_C100-200; Component Kind: Standard (No BOM); Component Type: Standard (No BOM); Pin Count: 1; Family: Fiducial; Socket: No; SMD: Yes; Sense: No; Status: None; ComponentHeight: 0mm; HelpURL: Undefined; Author: CERN DEM JLC; CreateDate: 09.02.2010; LatestRevisionDate: 04.04.2012; PackageDescription: Round Fiducial Target, Top Layer, 1.0mm, Top Solder 2.0mm, Keepout =2.0mm
IC6 = 74HC4066PW: Part Description: Quad Single-Pole Single-Throw Analog Switch; Manufacturer: NXP SEMICONDUCTORS; PressFit: No; Bonding: No; Table: Standard Logic; Part Number: 74HC4066PW; Component Kind: Standard; Component Type: Standard; Device: 74HC4066PW; PackageDescription: SOP, 14-Leads, Body 4.4x5mm (max), Pitch 0.65mm, IPC Medium Density; Manufacturer Part Number: 74HC4066PW; Pin Count: 14; Case: TSSOP14; Mounted: Yes; Socket: No; SMD: Yes; ComponentHeight: 1.1mm; Author: CERN DEM JLC; HelpURL: \\cern.ch\dfs\Applications\Altium\Datasheets\74HC4066PW.pdf; CreateDate: 2014-11-19; LatestRevisionDate: 2014-11-19
IC7 = TLC555ID: LinCMOS Timer; Manufacturer: TEXAS INSTRUMENTS; PressFit: No; Bonding: No; Part Number: TLC555ID; Component Kind: Standard; Component Type: Standard; Device: TLC555ID; PackageDescription: SOIC 8, Pitch 1.27mm, Body 4x5mm, IPC Medium Density; Part Description: LinCMOS Timer; Manufacturer Part Number: TLC555ID; Pin Count: 8; Case: SOIC8; Mounted: Yes; Socket: No; SMD: Yes; Sense: No; ComponentHeight: 1.75mm; Author: CERN DEM JMW; HelpURL: \\cern.ch\dfs\Applications\Altium\Datasheets\TLC555ID.pdf; CreateDate: 23.08.2016; LatestRevisionDate: 23.08.2016
IC8 = 74HC4066PW: Part Description: Quad Single-Pole Single-Throw Analog Switch; Manufacturer: NXP SEMICONDUCTORS; PressFit: No; Bonding: No; Part Number: 74HC4066PW; Component Kind: Standard; Component Type: Standard; Device: 74HC4066PW; PackageDescription: SOP, 14-Leads, Body 4.4x5mm (max), Pitch 0.65mm, IPC Medium Density; Manufacturer Part Number: 74HC4066PW; Pin Count: 14; Case: TSSOP14; Mounted: Yes; Socket: No; SMD: Yes; Sense: No; ComponentHeight: 1.1mm; Author: CERN DEM JLC; HelpURL: \\cern.ch\dfs\Applications\Altium\Datasheets\74HC4066PW.pdf; CreateDate: 19.11.2014; LatestRevisionDate: 19.11.2014
IC9 = 24AA025E48-I/SN: 1.7V-5.5V, 2K I2C™ Serial EEPROMs with EUI-48™ Node Identity; Manufacturer: MICROCHIP TECHNOLOGY; PressFit: No; Bonding: No; Part Number: 24AA025E48-I/SN; Component Kind: Standard; Component Type: Standard; Device: 24AA025E48-I/SN; PackageDescription: SOIC 8, Pitch 1.27mm - Body 4x5mm, IPC Medium Density; Part Description: 1.7V-5.5V, 2K I2C™ Serial EEPROMs with EUI-48™ Node Identity; Manufacturer Part Number: 24AA025E48-I/SN; Pin Count: 8; Case: SOIC8; Mounted: Yes; Socket: No; SMD: Yes; Sense: No; ComponentHeight: 1.75mm; HelpURL: \\cern.ch\dfs\Applications\Altium\Datasheets\24AA025E48-I-SN.pdf; Author: CERN DEM MR; CreateDate: 19.07.2016; LatestRevisionDate: 19.07.2016
IC15 = TCA9534APW: Low Voltage 8-Bit I2C and SMBUS Low-Power I/O Expander With Interrupt Output and Configuration Registers; Manufacturer: TEXAS INSTRUMENTS; PressFit: No; Bonding: No; Part Number: TCA9534APW; Component Kind: Standard; Component Type: Standard; Device: TCA9534APW; PackageDescription: SOP, 0.65mm Pitch; 16 Pin, 4.40mm W X 5.00mm L X 1.20mm H body, IPC Medium Density; Part Description: Low Voltage 8-Bit I2C and SMBUS Low-Power I/O Expander with Interrupt Output and Configuration Registers; Manufacturer Part Number: TCA9534APW; Pin Count: 16; Case: TSSOP16; Mounted: Yes; Socket: No; SMD: Yes; Sense: No; ComponentHeight: 1.2mm; Author: CERN DEM BC; HelpURL: \\cern.ch\dfs\Applications\Altium\Datasheets\TCA9534APW.pdf; CreateDate: 11.06.2020; LatestRevisionDate: 11.06.2020
R45 R48-R50 R52-R54 R125 R126 = R0402_10K_1%_0.0625W_100PPM: Resistor - 1%; Part Description: General Purpose Thick Film Chip Resistor; Manufacturer: GENERIC; Manufacturer1 Part Number: 232270671003L; TC: ±100ppm/°C; PressFit: No; Part Number: R0402_10K_1%_0.0625W_100PPM; Component Kind: Standard; Component Type: Standard; Pin Count: 2; Value: 10k; Status: Not Recommended; Power: 0.0625W; Manufacturer Part Number: R0402_10K_1%_0.0625W_100PPM; Case: 0402; Mounted: Yes; Sense: No; Socket: No; SMD: Yes; Manufacturer1 Example: YAGEO PHYCOMP; Manufacturer1 ComponentHeight: 0.4mm; HelpURL: \\cern.ch\dfs\Applications\Altium\Datasheets\R0402_Phycomp_RC0402.pdf; Author: CERN DEM JLC
  R45 R48 R52-R54 R125 R126: CreateDate: 2007-12-03; LatestRevisionDate: 2012-10-17
  R49 R50: Tolerance: ±1%; CreateDate: 03.12.2007; LatestRevisionDate: 17.10.2012
R46 = R0402_0R_JUMPER: Resistor; Part Description: 1A (0.05R Max DC Resistance) Zero Ohm Jumper; Manufacturer: GENERIC; Manufacturer1 Part Number: 232270591001L; Part Number: R0402_0R_JUMPER; Component Kind: Standard; Component Type: Standard; Pin Count: 2; Value: 0; Status: Not recommended; Manufacturer Part Number: R0402_0R_JUMPER; Case: 0402; Mounted: Yes; Sense: No; Socket: No; SMD: Yes; Manufacturer1 Example: YAGEO PHYCOMP; Manufacturer1 ComponentHeight: 0.4mm; HelpURL: \\cern.ch\dfs\Applications\Altium\Datasheets\R0402_Phycomp_RC0402.pdf; Author: CERN DEM JLC; CreateDate: 03.12.2007; LatestRevisionDate: 17.10.2012
R47 R51 = R0603_2K7_1%_0.1W_100PPM: Resistor - 1%; Part Description: General Purpose Thick Film Chip Resistor; Manufacturer: GENERIC; Manufacturer1 Part Number: RC0603FR-072K7L; Power: 0.1W; TC: ±100ppm/°C; PressFit: No; Part Number: R0603_2K7_1%_0.1W_100PPM; Component Kind: Standard; Component Type: Standard; Pin Count: 2; Value: 2k7; Status: Preferred; Manufacturer Part Number: R0603_2K7_1%_0.1W_100PPM; Case: 0603; Mounted: Yes; Sense: No; Socket: No; SMD: Yes; Manufacturer1 Example: YAGEO PHYCOMP; Manufacturer1 ComponentHeight: 0.55mm; HelpURL: \\cern.ch\dfs\Applications\Altium\Datasheets\R0603_PHYCOMP_RC0603.pdf; Author: CERN DEM JLC; CreateDate: 2011-05-02; LatestRevisionDate: 2011-05-02
R55 R56 = R0805_1M_1%_0.125W_100PPM: Resistor - 1%; Part Description: General Purpose Thick Film Chip Resistor; Manufacturer: GENERIC; Manufacturer1 Part Number: NRC10F1004TRF; Power: 0.125W; TC: ±100ppm/°C; PressFit: No; Part Number: R0805_1M_1%_0.125W_100PPM; Component Kind: Standard; Component Type: Standard; Pin Count: 2; Value: 1M; Status: Preferred; Manufacturer Part Number: R0805_1M_1%_0.125W_100PPM; Case: 0805; Mounted: Yes; Sense: No; Socket: No; SMD: Yes; Manufacturer1 Example: NIC COMPONENT; Manufacturer1 ComponentHeight: 0.6mm; HelpURL: \\cern.ch\dfs\Applications\Altium\Datasheets\R0805_NIC_NRC.pdf; Author: CERN DEM JLC; CreateDate: 03.12.2007; LatestRevisionDate: 13.03.2008
R98-R103 = R0603_10K_1%_0.1W_100PPM: Resistor - 1%; Part Description: General Purpose Thick Film Chip Resistor; Manufacturer: GENERIC; Manufacturer1 Part Number: NRC06F1002TRF; Power: 0.1W; TC: ±100ppm/°C; PressFit: No; Part Number: R0603_10K_1%_0.1W_100PPM; Component Kind: Standard; Component Type: Standard; Pin Count: 2; Value: 10k; Status: Preferred; Manufacturer Part Number: R0603_10K_1%_0.1W_100PPM; Case: 0603; Mounted: Yes; Sense: No; Socket: No; SMD: Yes; Manufacturer1 Example: NIC COMPONENT; Manufacturer1 ComponentHeight: 0.55mm; HelpURL: \\cern.ch\dfs\Applications\Altium\Datasheets\R0603_NIC_NRC.pdf; Author: CERN DEM JLC; CreateDate: 03.12.2007; LatestRevisionDate: 13.03.2008
R104-R109 = R0603_0R_JUMPER: Resistor; Part Description: 1A (0.05R Max DC Resistance) Zero Ohm Jumper; Manufacturer: GENERIC; Manufacturer1 Part Number: NRC06Z0; PressFit: No; Part Number: R0603_0R_JUMPER; Component Kind: Standard; Component Type: Standard; Pin Count: 2; Value: 0; Status: Preferred; Manufacturer Part Number: R0603_0R_JUMPER; Case: 0603; Mounted: Yes; Sense: No; Socket: No; SMD: Yes; Manufacturer1 Example: NIC COMPONENT; Manufacturer1 ComponentHeight: 0.55mm; HelpURL: \\cern.ch\dfs\Applications\Altium\Datasheets\R0603_NIC_NRC.pdf; Author: CERN DEM JLC; CreateDate: 03.12.2007; LatestRevisionDate: 13.03.2008
T1 = BSH103: N-CHANNEL MOSFET WITH DIODE; Part Description: 30V 850mA N-Channel Enhancement Mode Field-Effect Transistor; Manufacturer: NEXPERIA; PressFit: No; Bonding: No; Part Number: BSH103; Component Kind: Standard; Component Type: Standard; Device: BSH103; PackageDescription: SOT23, 0.95mm Pitch; 3 Pin, 1.30mm W X 2.90mm L X 1.10mm H body, IPC Medium Density; Manufacturer Part Number: BSH103; Pin Count: 3; Case: SOT23-3; Mounted: Yes; Socket: No; SMD: Yes; Sense: No; ComponentHeight: 1.1mm; HelpURL: \\cern.ch\dfs\Applications\Altium\Datasheets\BSH103.pdf; Author: CERN DEM JLC; CreateDate: 16.03.2010; LatestRevisionDate: 20.06.2017